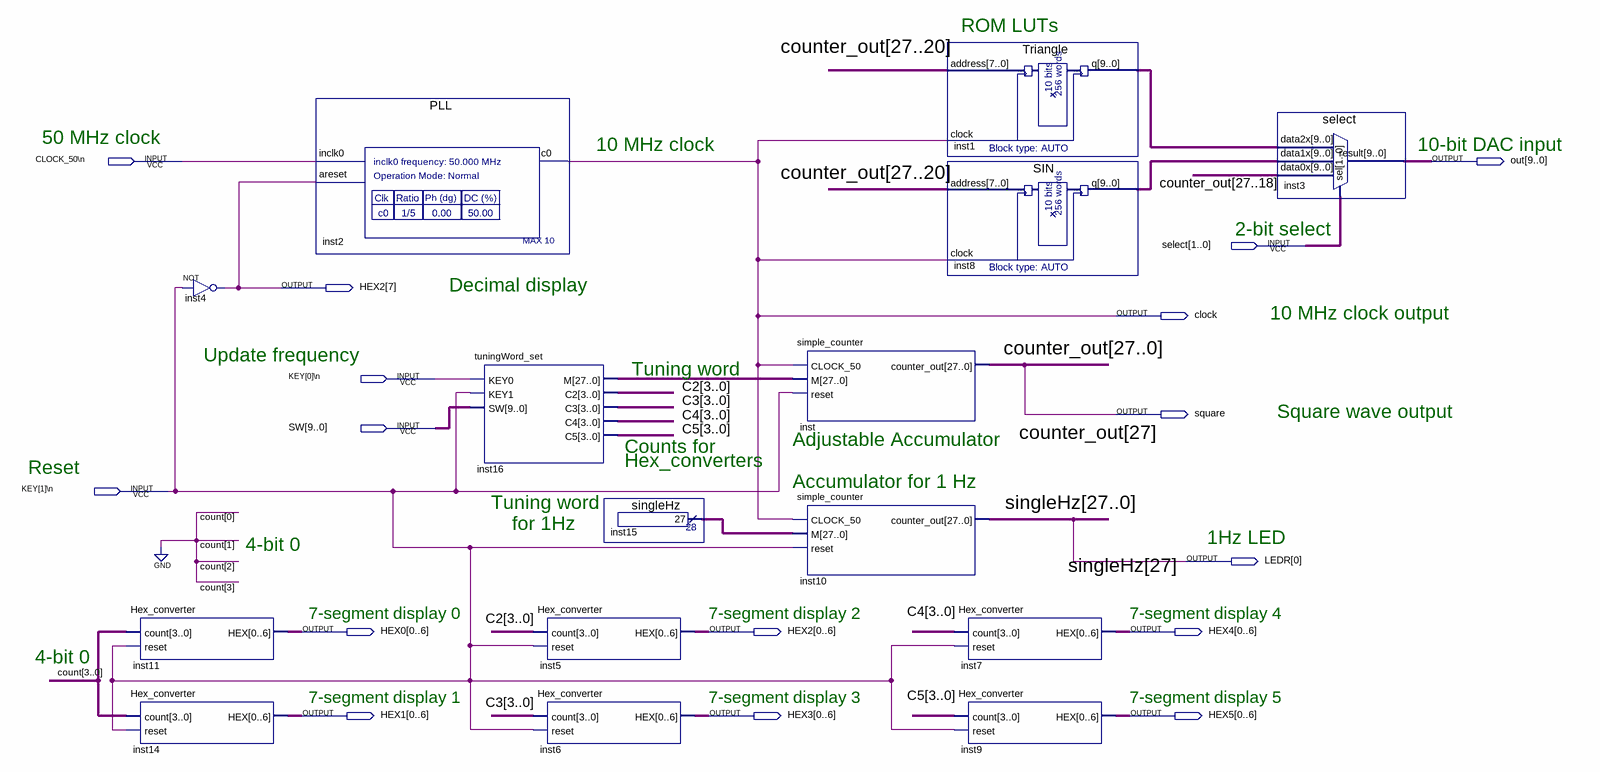
[diagram p0: schematic sheet]
// Quartus schematic project6.bdf as structural Verilog: 15 symbols, 16 pins
module project6 (
  input  \CLOCK_50\n ,
  input  [1:0] select,
  input  \KEY[0]\n ,
  input  [9:0] SW,
  input  \KEY[1]\n ,
  output [9:0] out,
  output [0:7] HEX2,
  output clock,
  output square,
  output [0:0] LEDR,
  output [0:6] HEX0,
  output [0:6] HEX4,
  output [0:6] HEX1,
  output [0:6] HEX3,
  output [0:6] HEX5
);

  wire [3:0] C2, C3, C4, C5;
  wire [9:0] inst1_q, inst8_q;
  wire [26:0] counter_out, singleHz;
  wire [27:0] inst15_result, inst16_m;

  Hex_converter inst11 (.count(4'b0000), .reset(\KEY[1]\n ), .HEX(HEX0));
  Hex_converter inst14 (.count(4'b0000), .reset(\KEY[1]\n ), .HEX(HEX1));
  not inst4 (HEX2[7], \KEY[1]\n );
  PLL inst2 (.inclk0(\CLOCK_50\n ), .areset(HEX2[7]), .c0(clock));
  tuningWord_set inst16 (
    .KEY0(\KEY[0]\n ), .KEY1(\KEY[1]\n ), .SW(SW), .M(inst16_m), .C2(C2), .C3(C3), .C4(C4), .C5(C5));
  Hex_converter inst5 (.count(C2), .reset(\KEY[1]\n ), .HEX(HEX2[0:6]));
  Hex_converter inst6 (.count(C3), .reset(\KEY[1]\n ), .HEX(HEX3));
  singleHz inst15 (.result(inst15_result));
  simple_counter inst (.CLOCK_50(clock), .M(inst16_m), .reset(\KEY[1]\n ), .counter_out({square, counter_out}));
  simple_counter inst10 (.CLOCK_50(clock), .M(inst15_result), .reset(\KEY[1]\n ), .counter_out({LEDR[0], singleHz}));
  Triangle inst1 (.address({square, counter_out[26:20]}), .clock(clock), .q(inst1_q));
  SIN inst8 (.address({square, counter_out[26:20]}), .clock(clock), .q(inst8_q));
  Hex_converter inst7 (.count(C4), .reset(\KEY[1]\n ), .HEX(HEX4));
  Hex_converter inst9 (.count(C5), .reset(\KEY[1]\n ), .HEX(HEX5));
  select inst3 (.data2x(inst1_q), .data1x(inst8_q), .data0x({square, counter_out[26:18]}), .sel(select), .result(out));

  // Other names for the same wires on the sheet: counter_out[27] = square; singleHz[27] = LEDR[0]

  // Notes on the sheet:
  //   ROM LUTs
  //   50 MHz clock
  //   10 MHz clock
  //   10-bit DAC input
  //   2-bit select
  //   Decimal display
  //   10 MHz clock output
  //   Update frequency
  //   Tuning word
  //   Square wave output
  //   Adjustable Accumulator
  //   Counts for
  //   Hex_converters
  //   Reset
  //   Accumulator for 1 Hz
  //   Tuning word
  //   for 1Hz
  //   1Hz LED
  //   4-bit 0
  //   7-segment display 0
  //   7-segment display 2
  //   7-segment display 4
  //   4-bit 0
  //   7-segment display 1
  //   7-segment display 3
  //   7-segment display 5
endmodule
